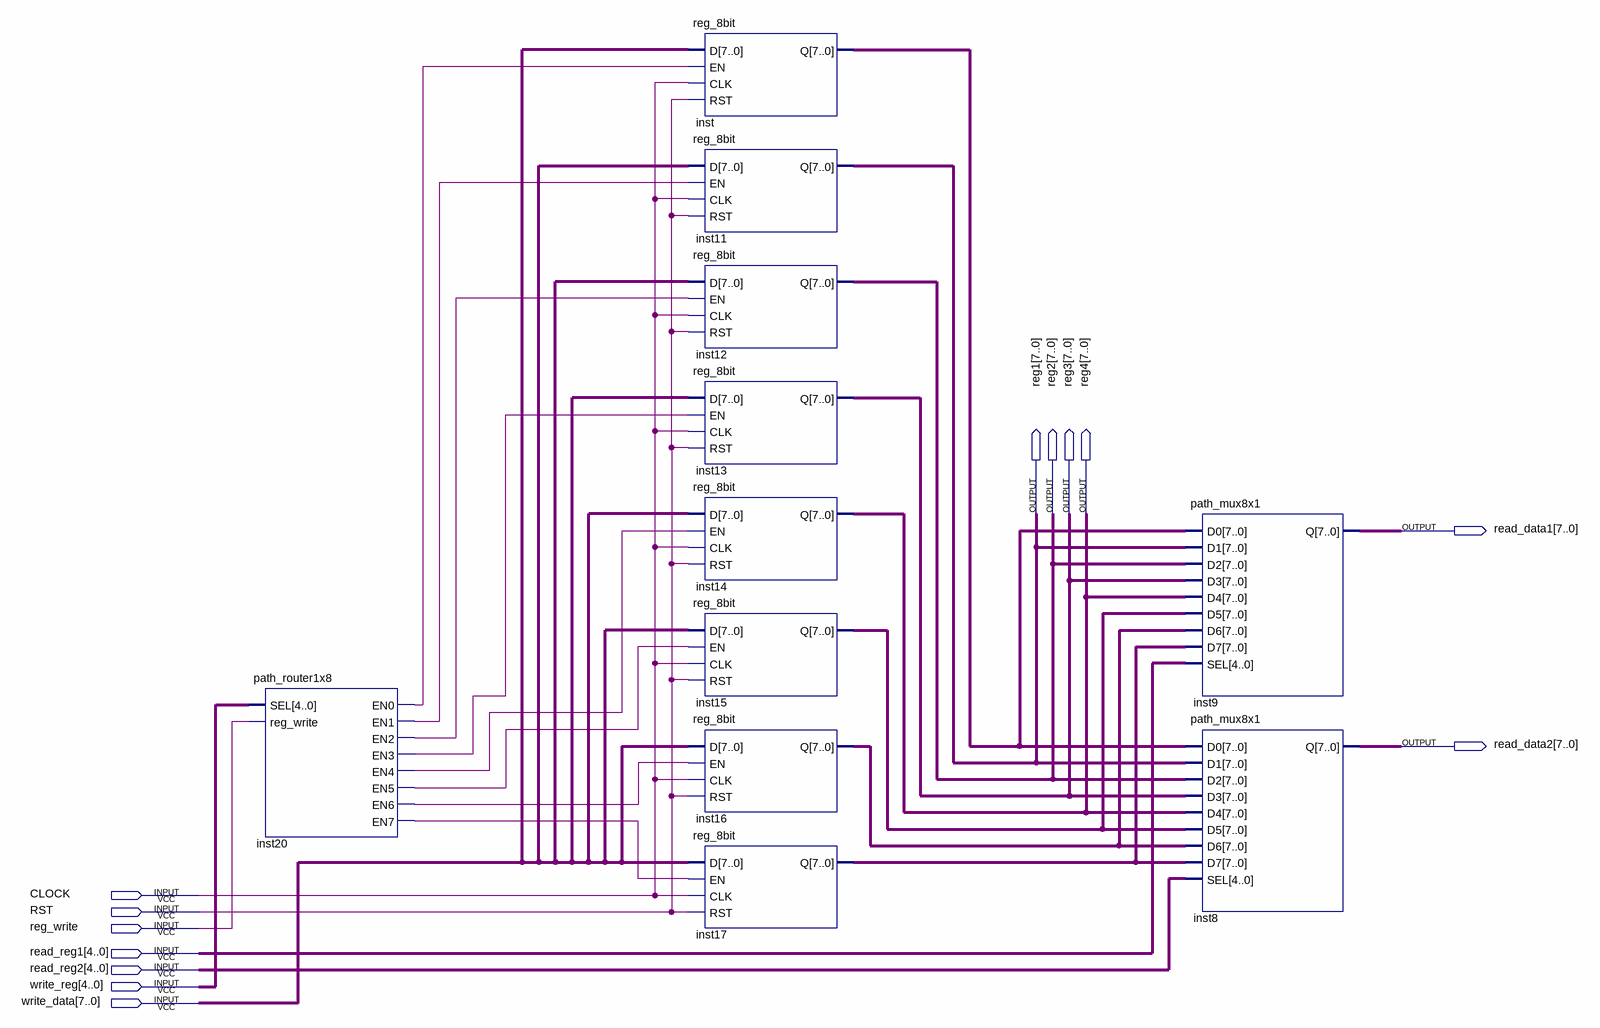
[diagram p0: schematic sheet]
// Quartus schematic reg_block.bdf as structural Verilog: 11 symbols, 13 pins
module reg_block (
  input  CLOCK,
  input  RST,
  input  reg_write,
  input  [4:0] read_reg1,
  input  [4:0] read_reg2,
  input  [4:0] write_reg,
  input  [7:0] write_data,
  output [7:0] reg1,
  output [7:0] reg2,
  output [7:0] reg3,
  output [7:0] reg4,
  output [7:0] read_data1,
  output [7:0] read_data2
);

  wire inst20_en0, inst20_en1, inst20_en2, inst20_en3, inst20_en4, inst20_en5, inst20_en6, inst20_en7;
  wire [7:0] inst15_q, inst16_q, inst17_q, inst_q;

  path_router1x8 inst20 (
    .SEL(write_reg), .reg_write(reg_write), .EN0(inst20_en0), .EN1(inst20_en1), .EN2(inst20_en2),
    .EN3(inst20_en3), .EN4(inst20_en4), .EN5(inst20_en5), .EN6(inst20_en6), .EN7(inst20_en7));
  reg_8bit inst (.D(write_data), .EN(inst20_en0), .CLK(CLOCK), .RST(RST), .Q(inst_q));
  reg_8bit inst11 (.D(write_data), .EN(inst20_en1), .CLK(CLOCK), .RST(RST), .Q(reg1));
  reg_8bit inst12 (.D(write_data), .EN(inst20_en2), .CLK(CLOCK), .RST(RST), .Q(reg2));
  reg_8bit inst13 (.D(write_data), .EN(inst20_en3), .CLK(CLOCK), .RST(RST), .Q(reg3));
  reg_8bit inst14 (.D(write_data), .EN(inst20_en4), .CLK(CLOCK), .RST(RST), .Q(reg4));
  reg_8bit inst15 (.D(write_data), .EN(inst20_en5), .CLK(CLOCK), .RST(RST), .Q(inst15_q));
  reg_8bit inst16 (.D(write_data), .EN(inst20_en6), .CLK(CLOCK), .RST(RST), .Q(inst16_q));
  reg_8bit inst17 (.D(write_data), .EN(inst20_en7), .CLK(CLOCK), .RST(RST), .Q(inst17_q));
  path_mux8x1 inst9 (
    .D0(inst_q), .D1(reg1), .D2(reg2), .D3(reg3), .D4(reg4), .D5(inst15_q), .D6(inst16_q), .D7(inst17_q),
    .SEL(read_reg1), .Q(read_data1));
  path_mux8x1 inst8 (
    .D0(inst_q), .D1(reg1), .D2(reg2), .D3(reg3), .D4(reg4), .D5(inst15_q), .D6(inst16_q), .D7(inst17_q),
    .SEL(read_reg2), .Q(read_data2));
endmodule
